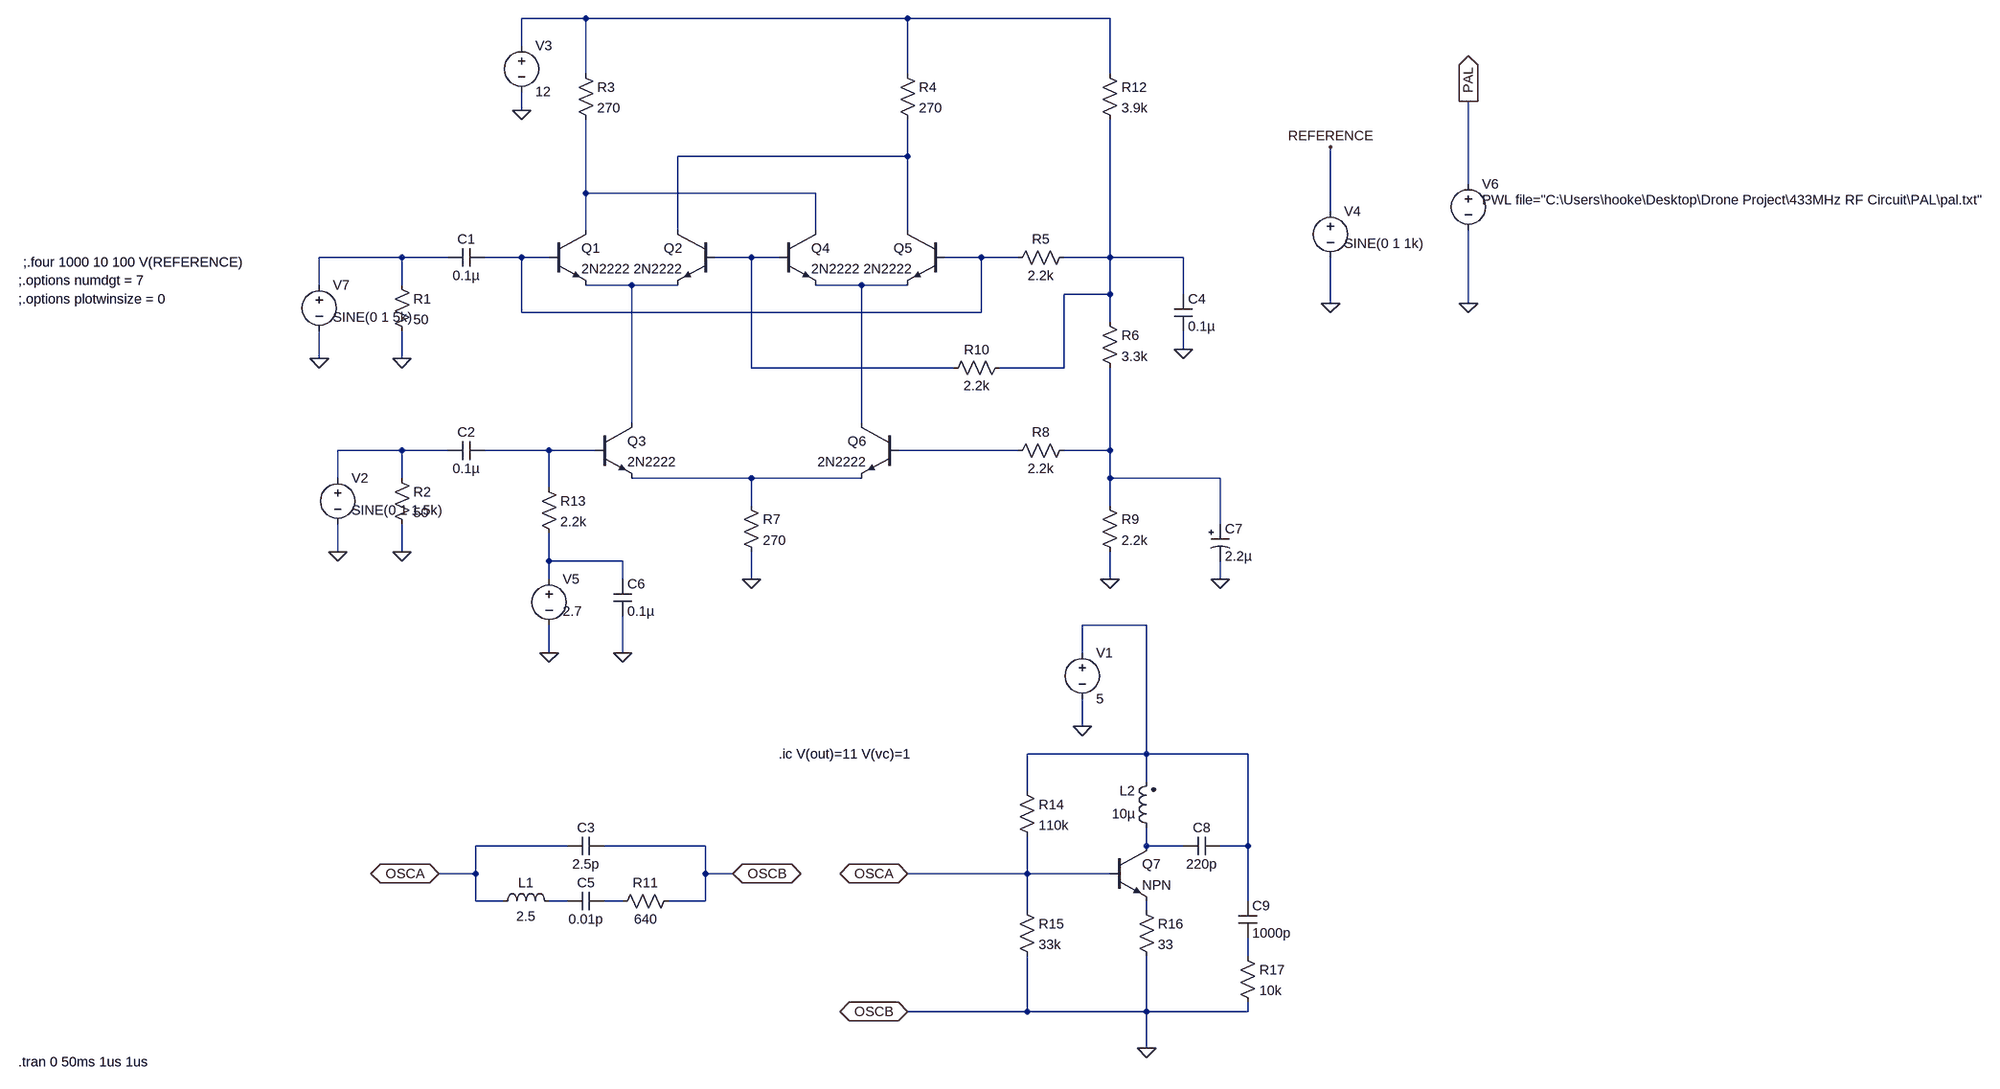
[diagram p0: schematic Gilbert_Cell_Mixer.asc]
Gilbert_Cell_Mixer.asc, the LTspice schematic file:
Version 4
SHEET 1 3892 1700
WIRE 368 -416 256 -416
WIRE 928 -416 368 -416
WIRE 1280 -416 928 -416
WIRE 256 -368 256 -416
WIRE 368 -320 368 -416
WIRE 928 -320 928 -416
WIRE 1280 -320 1280 -416
WIRE 256 -256 256 -288
WIRE 928 -176 928 -240
WIRE 928 -176 528 -176
WIRE 1904 -128 1904 -272
WIRE 368 -112 368 -240
WIRE 768 -112 368 -112
WIRE 1664 -80 1664 -192
WIRE 368 -48 368 -112
WIRE 528 -48 528 -176
WIRE 768 -48 768 -112
WIRE 928 -48 928 -176
WIRE 48 0 -96 0
WIRE 128 0 48 0
WIRE 256 0 192 0
WIRE 304 0 256 0
WIRE 656 0 592 0
WIRE 704 0 656 0
WIRE 1056 0 992 0
WIRE 1120 0 1056 0
WIRE 1280 0 1280 -240
WIRE 1280 0 1200 0
WIRE 1408 0 1280 0
WIRE -96 48 -96 0
WIRE 48 48 48 0
WIRE 448 48 368 48
WIRE 528 48 448 48
WIRE 848 48 768 48
WIRE 928 48 848 48
WIRE 1280 64 1280 0
WIRE 1280 64 1200 64
WIRE 1408 64 1408 0
WIRE 1664 80 1664 0
WIRE 1904 80 1904 -48
WIRE 256 96 256 0
WIRE 1056 96 1056 0
WIRE 1056 96 256 96
WIRE 1280 112 1280 64
WIRE 1408 160 1408 128
WIRE -96 176 -96 128
WIRE 48 176 48 128
WIRE 656 192 656 0
WIRE 1008 192 656 192
WIRE 1200 192 1200 64
WIRE 1200 192 1088 192
WIRE 448 288 448 48
WIRE 848 288 848 48
WIRE 48 336 -64 336
WIRE 128 336 48 336
WIRE 304 336 192 336
WIRE 384 336 304 336
WIRE 1120 336 912 336
WIRE 1280 336 1280 192
WIRE 1280 336 1200 336
WIRE -64 384 -64 336
WIRE 48 384 48 336
WIRE 656 384 448 384
WIRE 848 384 656 384
WIRE 1280 384 1280 336
WIRE 1472 384 1280 384
WIRE 304 400 304 336
WIRE 656 432 656 384
WIRE 1280 432 1280 384
WIRE 1472 464 1472 384
WIRE -64 512 -64 464
WIRE 48 512 48 464
WIRE 304 528 304 480
WIRE 432 528 304 528
WIRE 304 560 304 528
WIRE 432 560 432 528
WIRE 656 560 656 512
WIRE 1280 560 1280 512
WIRE 1472 560 1472 528
WIRE 1344 640 1232 640
WIRE 304 688 304 640
WIRE 432 688 432 624
WIRE 1232 688 1232 640
WIRE 1232 816 1232 768
WIRE 1344 864 1344 640
WIRE 1344 864 1136 864
WIRE 1520 864 1344 864
WIRE 1344 912 1344 864
WIRE 1136 928 1136 864
WIRE 336 1024 176 1024
WIRE 576 1024 400 1024
WIRE 1344 1024 1344 992
WIRE 1408 1024 1344 1024
WIRE 1520 1024 1520 864
WIRE 1520 1024 1472 1024
WIRE 176 1072 176 1024
WIRE 176 1072 112 1072
WIRE 576 1072 576 1024
WIRE 624 1072 576 1072
WIRE 1136 1072 1136 1008
WIRE 1136 1072 928 1072
WIRE 1280 1072 1136 1072
WIRE 176 1120 176 1072
WIRE 224 1120 176 1120
WIRE 336 1120 304 1120
WIRE 432 1120 400 1120
WIRE 576 1120 576 1072
WIRE 576 1120 512 1120
WIRE 1520 1120 1520 1024
WIRE 1136 1136 1136 1072
WIRE 1344 1136 1344 1120
WIRE 1520 1216 1520 1184
WIRE 1136 1312 1136 1216
WIRE 1136 1312 928 1312
WIRE 1344 1312 1344 1216
WIRE 1344 1312 1136 1312
WIRE 1520 1312 1520 1296
WIRE 1520 1312 1344 1312
WIRE 1344 1376 1344 1312
FLAG 48 176 0
FLAG -64 512 0
FLAG 48 512 0
FLAG 256 -256 0
FLAG 656 560 0
FLAG 1280 560 0
FLAG 1408 160 0
FLAG 1472 560 0
FLAG 1664 -192 REFERENCE
FLAG 1664 80 0
FLAG 304 688 0
FLAG 432 688 0
FLAG 1904 80 0
FLAG 1904 -272 PAL
IOPIN 1904 -272 Out
FLAG 112 1072 OSCA
IOPIN 112 1072 BiDir
FLAG 624 1072 OSCB
IOPIN 624 1072 BiDir
FLAG 928 1072 OSCA
IOPIN 928 1072 BiDir
FLAG 928 1312 OSCB
IOPIN 928 1312 BiDir
FLAG 1344 1376 0
FLAG 1232 816 0
FLAG -96 176 0
SYMBOL res 32 32 R0
SYMATTR InstName R1
SYMATTR Value 50
SYMBOL cap 192 -16 R90
WINDOW 0 0 32 VBottom 2
WINDOW 3 32 32 VTop 2
SYMATTR InstName C1
SYMATTR Value 0.1µ
SYMBOL voltage -64 368 R0
WINDOW 123 24 44 Left 2
WINDOW 39 0 0 Left 0
WINDOW 3 24 72 Left 2
SYMATTR Value SINE(0 1 1.5k)
SYMATTR InstName V2
SYMBOL res 32 368 R0
SYMATTR InstName R2
SYMATTR Value 50
SYMBOL cap 192 320 R90
WINDOW 0 0 32 VBottom 2
WINDOW 3 32 32 VTop 2
SYMATTR InstName C2
SYMATTR Value 0.1µ
SYMBOL npn 304 -48 R0
SYMATTR InstName Q1
SYMATTR Value 2N2222
SYMBOL npn 592 -48 M0
SYMATTR InstName Q2
SYMATTR Value 2N2222
SYMBOL npn 384 288 R0
SYMATTR InstName Q3
SYMATTR Value 2N2222
SYMBOL npn 704 -48 R0
SYMATTR InstName Q4
SYMATTR Value 2N2222
SYMBOL npn 992 -48 M0
SYMATTR InstName Q5
SYMATTR Value 2N2222
SYMBOL res 352 -336 R0
SYMATTR InstName R3
SYMATTR Value 270
SYMBOL res 912 -336 R0
SYMATTR InstName R4
SYMATTR Value 270
SYMBOL voltage 256 -384 R0
WINDOW 123 0 0 Left 0
WINDOW 39 0 0 Left 0
SYMATTR InstName V3
SYMATTR Value 12
SYMBOL res 1216 -16 R90
WINDOW 0 0 56 VBottom 2
WINDOW 3 32 56 VTop 2
SYMATTR InstName R5
SYMATTR Value 2.2k
SYMBOL res 1264 96 R0
SYMATTR InstName R6
SYMATTR Value 3.3k
SYMBOL npn 912 288 M0
SYMATTR InstName Q6
SYMATTR Value 2N2222
SYMBOL res 640 416 R0
SYMATTR InstName R7
SYMATTR Value 270
SYMBOL res 1216 320 R90
WINDOW 0 0 56 VBottom 2
WINDOW 3 32 56 VTop 2
SYMATTR InstName R8
SYMATTR Value 2.2k
SYMBOL res 1264 416 R0
SYMATTR InstName R9
SYMATTR Value 2.2k
SYMBOL res 1104 176 R90
WINDOW 0 0 56 VBottom 2
WINDOW 3 32 56 VTop 2
SYMATTR InstName R10
SYMATTR Value 2.2k
SYMBOL cap 1392 64 R0
SYMATTR InstName C4
SYMATTR Value 0.1µ
SYMBOL res 1264 -336 R0
SYMATTR InstName R12
SYMATTR Value 3.9k
SYMBOL voltage 1664 -96 R0
WINDOW 123 24 44 Left 2
WINDOW 39 0 0 Left 0
WINDOW 3 24 72 Left 2
SYMATTR Value SINE(0 1 1k)
SYMATTR InstName V4
SYMBOL res 288 384 R0
SYMATTR InstName R13
SYMATTR Value 2.2k
SYMBOL voltage 304 544 R0
WINDOW 3 24 72 Left 2
WINDOW 123 24 44 Left 2
WINDOW 39 0 0 Left 0
SYMATTR Value 2.7
SYMATTR InstName V5
SYMBOL cap 416 560 R0
SYMATTR InstName C6
SYMATTR Value 0.1µ
SYMBOL polcap 1456 464 R0
SYMATTR InstName C7
SYMATTR Value 2.2µ
SYMBOL voltage 1904 -144 R0
WINDOW 123 0 0 Left 0
WINDOW 39 0 0 Left 0
WINDOW 3 24 44 Left 2
SYMATTR Value PWL file="C:\Users\hooke\Desktop\Drone Project\433MHz RF Circuit\PAL\pal.txt"
SYMATTR InstName V6
SYMBOL cap 400 1008 R90
WINDOW 0 0 32 VBottom 2
WINDOW 3 32 32 VTop 2
SYMATTR InstName C3
SYMATTR Value 2.5p
SYMBOL ind 208 1136 R270
WINDOW 0 32 56 VTop 2
WINDOW 3 5 56 VBottom 2
SYMATTR InstName L1
SYMATTR Value 2.5
SYMBOL cap 400 1104 R90
WINDOW 0 0 32 VBottom 2
WINDOW 3 32 32 VTop 2
SYMATTR InstName C5
SYMATTR Value 0.01p
SYMBOL res 528 1104 R90
WINDOW 0 0 56 VBottom 2
WINDOW 3 32 56 VTop 2
SYMATTR InstName R11
SYMATTR Value 640
SYMBOL res 1120 912 R0
SYMATTR InstName R14
SYMATTR Value 110k
SYMBOL res 1120 1120 R0
SYMATTR InstName R15
SYMATTR Value 33k
SYMBOL npn 1280 1024 R0
SYMATTR InstName Q7
SYMBOL res 1328 1120 R0
SYMATTR InstName R16
SYMATTR Value 33
SYMBOL ind2 1360 1008 R180
WINDOW 0 36 80 Left 2
WINDOW 3 36 40 Left 2
SYMATTR InstName L2
SYMATTR Value 10µ
SYMATTR Type ind
SYMBOL cap 1472 1008 R90
WINDOW 0 0 32 VBottom 2
WINDOW 3 32 32 VTop 2
SYMATTR InstName C8
SYMATTR Value 220p
SYMBOL cap 1504 1120 R0
SYMATTR InstName C9
SYMATTR Value 1000p
SYMBOL res 1504 1200 R0
SYMATTR InstName R17
SYMATTR Value 10k
SYMBOL voltage 1232 672 R0
WINDOW 123 0 0 Left 0
WINDOW 39 0 0 Left 0
SYMATTR InstName V1
SYMATTR Value 5
SYMBOL voltage -96 32 R0
WINDOW 123 24 44 Left 2
WINDOW 39 0 0 Left 0
WINDOW 3 24 72 Left 2
SYMATTR Value SINE(0 1 5k)
SYMATTR InstName V7
TEXT -648 40 Left 2 !;.options numdgt = 7
TEXT -648 72 Left 2 !;.options plotwinsize = 0
TEXT -640 8 Left 2 !;.four 1000 10 100 V(REFERENCE)
TEXT -648 1400 Left 2 !.tran 0 50ms 1us 1us
TEXT 704 864 Left 2 !.ic V(out)=11 V(vc)=1

The netlist it stands for:
* Gilbert_Cell_Mixer.asc
R1 N004 0 50
C1 N005 N004 0.1µ
V2 N010 0 SINE(0 1 1.5k)
R2 N010 0 50
C2 N011 N010 0.1µ
Q1 N003 N005 N008 0 2N2222
Q2 N002 N006 N008 0 2N2222
Q3 N008 N011 N014 0 2N2222
Q4 N003 N006 N009 0 2N2222
Q5 N002 N005 N009 0 2N2222
R3 N001 N003 270
R4 N001 N002 270
V3 N001 0 12
R5 N007 N005 2.2k
R6 N007 N013 3.3k
Q6 N009 N012 N014 0 2N2222
R7 N014 0 270
R8 N013 N012 2.2k
R9 N013 0 2.2k
R10 N007 N006 2.2k
C4 N007 0 0.1µ
R12 N001 N007 3.9k
V4 REFERENCE 0 SINE(0 1 1k)
R13 N011 N015 2.2k
V5 N015 0 2.7
C6 N015 0 0.1µ
C7 N013 0 2.2µ
V6 PAL 0 PWL file="C:\Users\hooke\Desktop\Drone Project\433MHz RF Circuit\PAL\pal.txt"
C3 0 OSCA 2.5p
L1 OSCA N018 2.5
C5 N019 N018 0.01p
R11 0 N019 640
R14 N016 OSCA 110k
R15 OSCA 0 33k
Q7 N017 OSCA N020 0 NPN
R16 N020 0 33
L2 N017 N016 10µ
C8 N016 N017 220p
C9 N016 N021 1000p
R17 N021 0 10k
V1 N016 0 5
V7 N004 0 SINE(0 1 5k)
.model NPN NPN
.model PNP PNP
.lib standard.bjt
;.options numdgt = 7
;.options plotwinsize = 0
;.four 1000 10 100 V(REFERENCE)
.tran 0 50ms 1us 1us
.ic V(out)=11 V(vc)=1
.backanno
.end